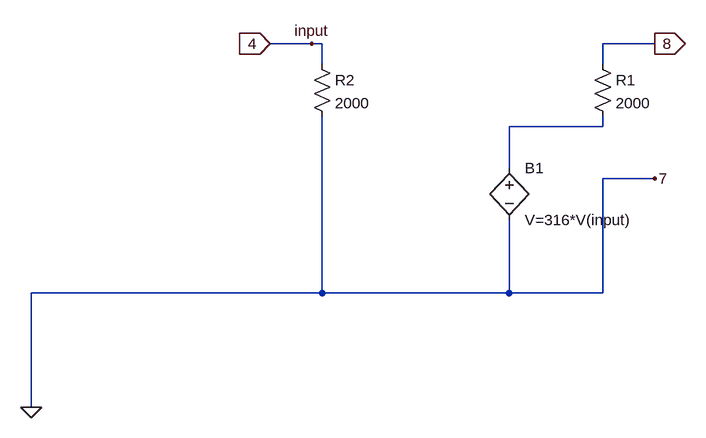
[diagram p0: schematic MC1350.asc]
MC1350.asc, the LTspice schematic file:
Version 4.1
SHEET 1 1148 824
WIRE 432 192 368 192
WIRE 448 192 432 192
WIRE 960 192 880 192
WIRE 448 224 448 192
WIRE 880 224 880 192
WIRE 880 320 880 304
WIRE 880 320 736 320
WIRE 736 384 736 320
WIRE 960 400 880 400
WIRE 448 576 448 304
WIRE 448 576 0 576
WIRE 736 576 736 464
WIRE 736 576 448 576
WIRE 880 576 880 400
WIRE 880 576 736 576
WIRE 0 752 0 576
FLAG 0 752 0
FLAG 960 192 8
IOPIN 960 192 Out
FLAG 960 400 7
FLAG 368 192 4
IOPIN 368 192 In
FLAG 432 192 input
SYMBOL res 864 208 R0
SYMATTR InstName R1
SYMATTR Value 2000
SYMBOL res 432 208 R0
SYMATTR InstName R2
SYMATTR Value 2000
SYMBOL bv 736 368 R0
SYMATTR InstName B1
SYMATTR Value V=316*V(input)

The netlist it stands for:
* MC1350.asc
R1 8 N001 2000
R2 input 0 2000
B1 N001 0 V=316*V(input)
.backanno
.end